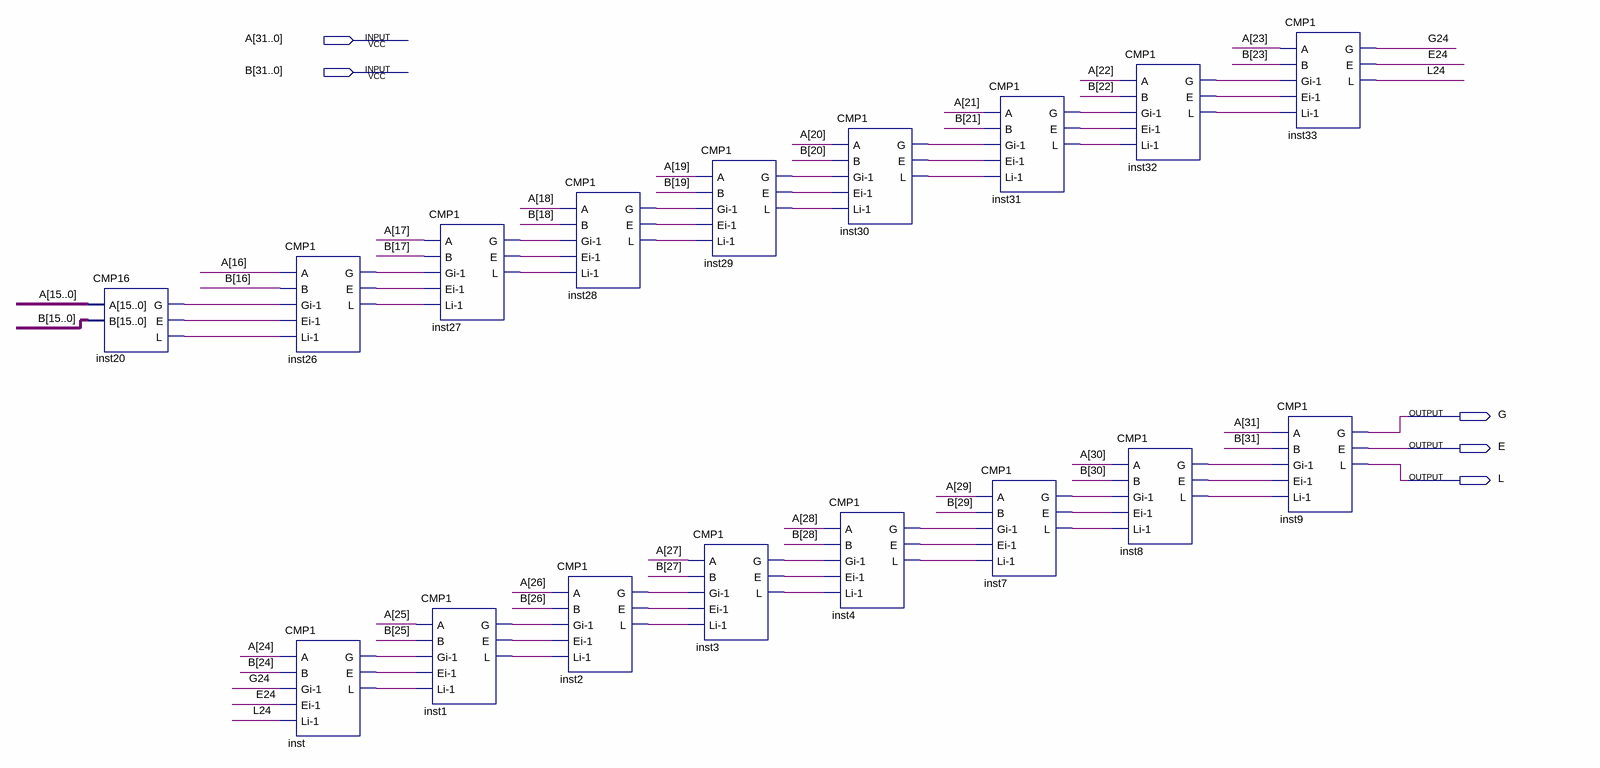
[diagram p0: schematic sheet]
// Quartus schematic CMP32.bdf as structural Verilog: 17 symbols, 5 pins
module CMP32 (
  input  [31:0] A,
  input  [31:0] B,
  output G,
  output E,
  output L
);

  wire E24, G24, inst1_e, inst1_g, inst1_l, inst2_e, inst2_g, inst2_l, inst3_e, inst3_g, inst3_l, inst4_e,
       inst4_g, inst4_l, inst7_e, inst7_g, inst7_l, inst8_e, inst8_g, inst8_l, inst20_e, inst20_g, inst20_l,
       inst26_e, inst26_g, inst26_l, inst27_e, inst27_g, inst27_l, inst28_e, inst28_g, inst28_l, inst29_e,
       inst29_g, inst29_l, inst30_e, inst30_g, inst30_l, inst31_e, inst31_g, inst31_l, inst32_e, inst32_g,
       inst32_l, inst_e, inst_g, inst_l, L24;

  CMP16 inst20 (.A(A[15:0]), .B(B[15:0]), .G(inst20_g), .E(inst20_e), .L(inst20_l));
  CMP1 inst26 (
    .A(A[16]), .B(B[16]), .\Gi-1 (inst20_g), .\Ei-1 (inst20_e), .\Li-1 (inst20_l), .G(inst26_g),
    .E(inst26_e), .L(inst26_l));
  CMP1 inst (.A(A[24]), .B(B[24]), .\Gi-1 (G24), .\Ei-1 (E24), .\Li-1 (L24), .G(inst_g), .E(inst_e), .L(inst_l));
  CMP1 inst27 (
    .A(A[17]), .B(B[17]), .\Gi-1 (inst26_g), .\Ei-1 (inst26_e), .\Li-1 (inst26_l), .G(inst27_g),
    .E(inst27_e), .L(inst27_l));
  CMP1 inst1 (
    .A(A[25]), .B(B[25]), .\Gi-1 (inst_g), .\Ei-1 (inst_e), .\Li-1 (inst_l), .G(inst1_g), .E(inst1_e),
    .L(inst1_l));
  CMP1 inst28 (
    .A(A[18]), .B(B[18]), .\Gi-1 (inst27_g), .\Ei-1 (inst27_e), .\Li-1 (inst27_l), .G(inst28_g),
    .E(inst28_e), .L(inst28_l));
  CMP1 inst2 (
    .A(A[26]), .B(B[26]), .\Gi-1 (inst1_g), .\Ei-1 (inst1_e), .\Li-1 (inst1_l), .G(inst2_g), .E(inst2_e),
    .L(inst2_l));
  CMP1 inst3 (
    .A(A[27]), .B(B[27]), .\Gi-1 (inst2_g), .\Ei-1 (inst2_e), .\Li-1 (inst2_l), .G(inst3_g), .E(inst3_e),
    .L(inst3_l));
  CMP1 inst29 (
    .A(A[19]), .B(B[19]), .\Gi-1 (inst28_g), .\Ei-1 (inst28_e), .\Li-1 (inst28_l), .G(inst29_g),
    .E(inst29_e), .L(inst29_l));
  CMP1 inst30 (
    .A(A[20]), .B(B[20]), .\Gi-1 (inst29_g), .\Ei-1 (inst29_e), .\Li-1 (inst29_l), .G(inst30_g),
    .E(inst30_e), .L(inst30_l));
  CMP1 inst4 (
    .A(A[28]), .B(B[28]), .\Gi-1 (inst3_g), .\Ei-1 (inst3_e), .\Li-1 (inst3_l), .G(inst4_g), .E(inst4_e),
    .L(inst4_l));
  CMP1 inst31 (
    .A(A[21]), .B(B[21]), .\Gi-1 (inst30_g), .\Ei-1 (inst30_e), .\Li-1 (inst30_l), .G(inst31_g),
    .E(inst31_e), .L(inst31_l));
  CMP1 inst7 (
    .A(A[29]), .B(B[29]), .\Gi-1 (inst4_g), .\Ei-1 (inst4_e), .\Li-1 (inst4_l), .G(inst7_g), .E(inst7_e),
    .L(inst7_l));
  CMP1 inst32 (
    .A(A[22]), .B(B[22]), .\Gi-1 (inst31_g), .\Ei-1 (inst31_e), .\Li-1 (inst31_l), .G(inst32_g),
    .E(inst32_e), .L(inst32_l));
  CMP1 inst8 (
    .A(A[30]), .B(B[30]), .\Gi-1 (inst7_g), .\Ei-1 (inst7_e), .\Li-1 (inst7_l), .G(inst8_g), .E(inst8_e),
    .L(inst8_l));
  CMP1 inst33 (
    .A(A[23]), .B(B[23]), .\Gi-1 (inst32_g), .\Ei-1 (inst32_e), .\Li-1 (inst32_l), .G(G24), .E(E24), .L(L24));
  CMP1 inst9 (.A(A[31]), .B(B[31]), .\Gi-1 (inst8_g), .\Ei-1 (inst8_e), .\Li-1 (inst8_l), .G(G), .E(E), .L(L));
endmodule
